# EAGLE schematic gforce_single_board (EAGLE 7.1.0)
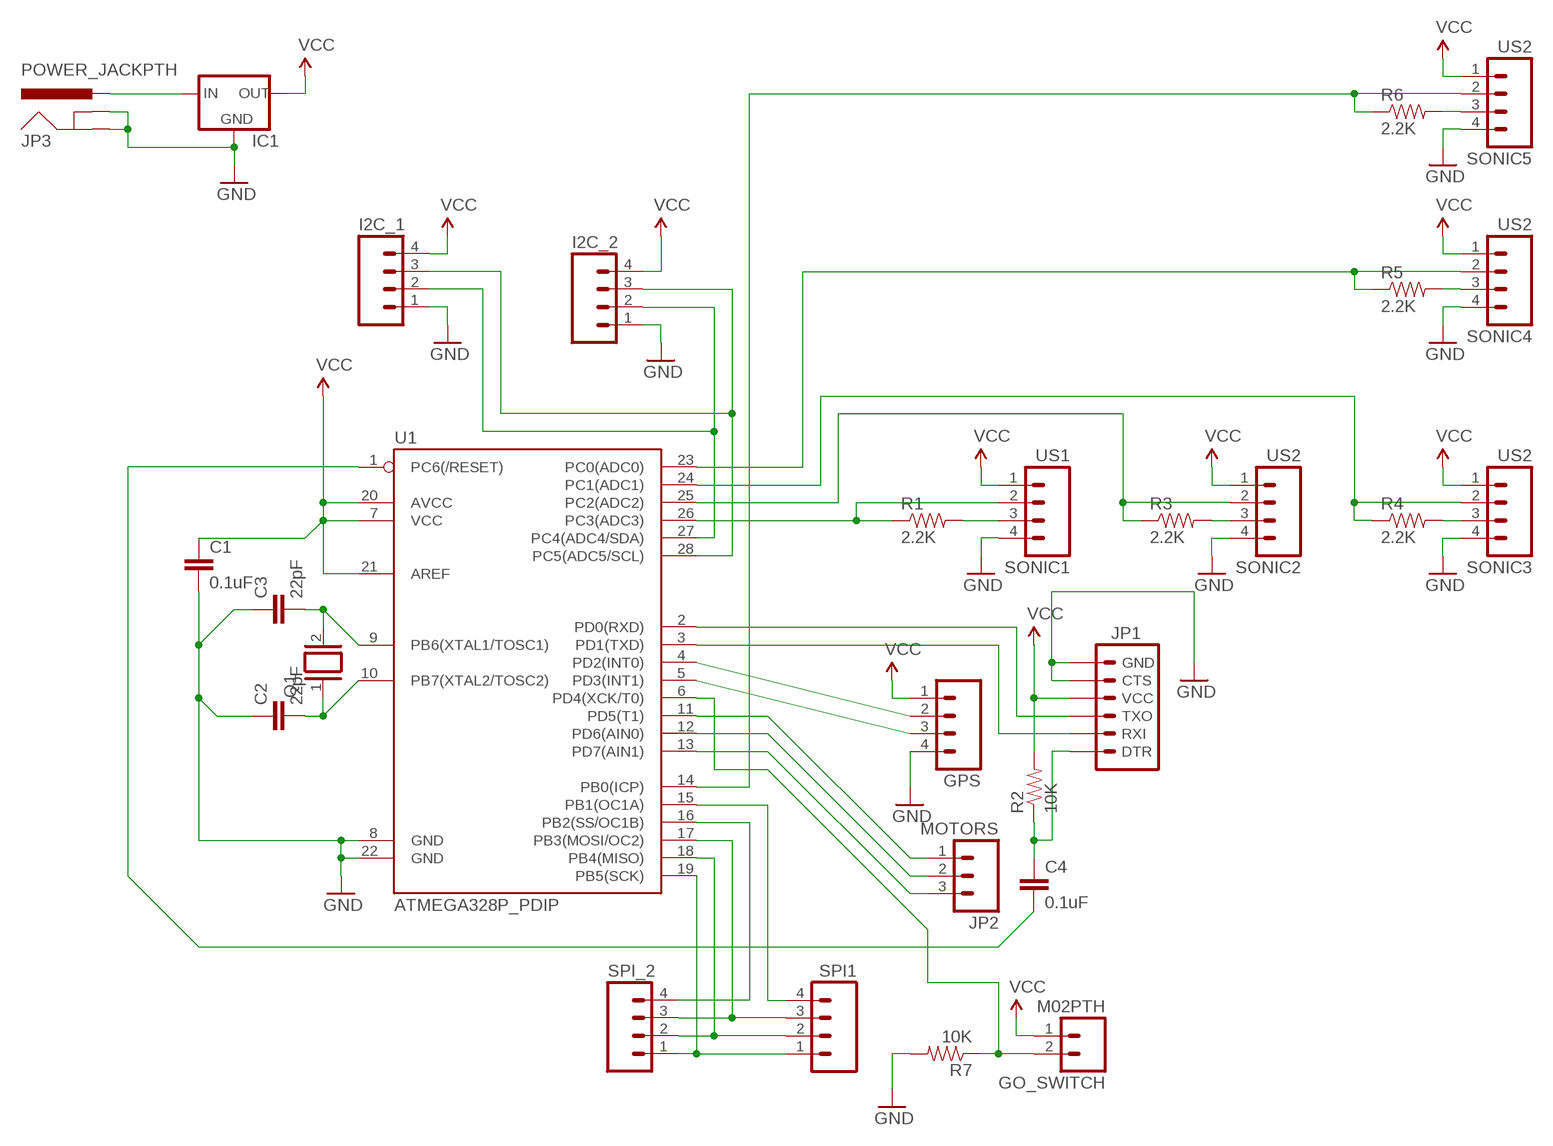
[diagram p0: schematic, sheet 1]

## Parts
C1  0.1uF  CAPPTH  [CAP-PTH-SMALL]
C2  22pF  CAPPTH  [CAP-PTH-SMALL]
C3  22pF  CAPPTH  [CAP-PTH-SMALL]
C4  0.1uF  CAPPTH  [CAP-PTH-SMALL]
GO_SWITCH  M02PTH  [1X02]
GPS  M04PTH  [1X04]
I2C_1  M04PTH  [1X04]
I2C_2  M04PTH  [1X04]
IC1  V_REG_78XX-TO-220  [TO-220-ALT]
JP1  ARDUINO_SERIAL_PROGRAMPTH  [1X06]
JP2  MOTORS  M03PTH  [1X03]
JP3  POWER_JACKPTH  [POWER_JACK_PTH]
Q1  XTAL/S  [QS]
R1  2.2K  RESISTORPTH-1/4W  [AXIAL-0.4]
R2  10K  RESISTORPTH-1/4W  [AXIAL-0.4]
R3  2.2K  RESISTORPTH-1/4W  [AXIAL-0.4]
R4  2.2K  RESISTORPTH-1/4W  [AXIAL-0.4]
R5  2.2K  RESISTORPTH-1/4W  [AXIAL-0.4]
R6  2.2K  RESISTORPTH-1/4W  [AXIAL-0.4]
R7  10K  RESISTORPTH-1/4W  [AXIAL-0.4]
SONIC1  US1  M04PTH  [1X04]
SONIC2  US2  M04PTH  [1X04]
SONIC3  US2  M04PTH  [1X04]
SONIC4  US2  M04PTH  [1X04]
SONIC5  US2  M04PTH  [1X04]
SPI1  M04PTH  [1X04]
SPI_2  M04PTH  [1X04]
U1  ATMEGA328P_PDIP  [DIL28-3]

## Nets
GND: C1.2 C2.1 C3.1 GPS.4 I2C_1.1 I2C_2.1 IC1.GND JP1.5(CTS) JP1.6(GND) JP3.GND JP3.GNDBREAK R7.P$2 SONIC1.4 SONIC2.4 SONIC3.4 SONIC4.4 SONIC5.4 U1.8(GND) U1.22(GND)
MISO: SPI1.2 SPI_2.2 U1.18(PB4(MISO))
MOSI: SPI1.3 SPI_2.3 U1.17(PB3(MOSI/OC2))
N$1: I2C_1.2 I2C_2.2 U1.27(PC4(ADC4/SDA))
N$2: I2C_1.3 I2C_2.3 U1.28(PC5(ADC5/SCL))
N$3: GPS.2 U1.4(PD2(INT0))
N$4: GPS.3 U1.5(PD3(INT1))
N$5: C3.2 Q1.2 U1.9(PB6(XTAL1/TOSC1))
N$6: C2.2 Q1.1 U1.10(PB7(XTAL2/TOSC2))
N$7: JP1.2(RXI) U1.3(PD1(TXD))
N$8: JP1.3(TXO) U1.2(PD0(RXD))
N$9: C4.2 U1.1(PC6(/RESET))
N$10: C4.1 JP1.1(DTR) R2.P$1
N$11: R3.P$2 SONIC2.3
N$12: R3.P$1 SONIC2.2 U1.25(PC2(ADC2))
N$13: JP2.1 U1.11(PD5(T1))
N$14: R4.P$2 SONIC3.3
N$15: R4.P$1 SONIC3.2 U1.24(PC1(ADC1))
N$16: R6.P$2 SONIC5.3
N$17: R6.P$1 SONIC5.2 U1.14(PB0(ICP))
N$18: JP2.2 U1.12(PD6(AIN0))
N$19: R5.P$2 SONIC4.3
N$20: R5.P$1 SONIC4.2 U1.23(PC0(ADC0))
N$21: JP2.3 U1.13(PD7(AIN1))
N$22: SPI_2.4 U1.16(PB2(SS/OC1B))
N$23: SPI1.4 U1.15(PB1(OC1A))
N$26: GO_SWITCH.2 R7.P$1 U1.6(PD4(XCK/T0))
N$27: IC1.IN JP3.PWR
SCK: SPI1.1 SPI_2.1 U1.19(PB5(SCK))
SONIC1_ECHO: R1.P$2 SONIC1.3
SONIC1_TRIGGER: R1.P$1 SONIC1.2 U1.26(PC3(ADC3))
VCC: C1.1 GO_SWITCH.1 GPS.1 I2C_1.4 I2C_2.4 IC1.OUT JP1.4(VCC) R2.P$2 SONIC1.1 SONIC2.1 SONIC3.1 SONIC4.1 SONIC5.1 U1.7(VCC) U1.20(AVCC) U1.21(AREF)

## Library data of the parts
C1-C4 = SparkFun-Passives:CAP: Capacitor Standard 0603 ceramic capacitor, and 0.1" leaded capacitor.
GO_SWITCH = SparkFun-Connectors:M02: Standard 2-pin 0.1" header. Use with - straight break away headers ( PRT-00116) - right angle break away headers (PRT-00553) - swiss pins (PRT-00743) - machine pins (PRT-00117) - female headers (PRT-00115) Molex polarized connector foot print use with: PRT-08233 with associated crimp pins and housings. 2.54_SCREWTERM for use with PRT-10571. 3.5mm Screw Terminal footprints for PRT-08084 5mm Screw Terminal footprints for use with PRT-08432
GPS I2C_1 I2C_2 SONIC1-SONIC5 SPI1 SPI_2 = SparkFun-Connectors:M04: Header 4 Standard 4-pin 0.1" header. Use with straight break away headers (SKU : PRT-00116), right angle break away headers (PRT-00553), swiss pins (PRT-00743), machine pins (PRT-00117), and female headers (PRT-00115). Molex polarized connector foot print use with SKU : PRT-08231 with associated crimp pins and housings. 1MM SMD Version SKU: PRT-10208
IC1 = SparkFun-PowerIC:V_REG_78XX: Voltage Regulator Standard 7805 5V regulator. IGO (Input Ground Output). Spark Fun Electronics SKU : COM-00107
JP1 = SparkFun-Connectors:ARDUINO_SERIAL_PROGRAM: FTDI connector footprints
JP2 = SparkFun-Connectors:M03: Header 3 Standard 3-pin 0.1" header. Use with straight break away headers (SKU : PRT-00116), right angle break away headers (PRT-00553), swiss pins (PRT-00743), machine pins (PRT-00117), and female headers (PRT-00115). Molex polarized connector foot print use with SKU : PRT-08232 with associated crimp pins and housings.
JP3 = SparkFun-Connectors:POWER_JACK: Power Jack This is the standard 5.5mm barrel jack for power. The PTH is the most common, proven, reliable, footprint. The Slot footprint only works if the mill layer is transmitted to the PCB fab house so be warned. Mating wall wart : TOL-00298 (and others); PROD_ID: CONN-08197
Q1 = special:XTAL/S: CRYSTAL
R1-R7 = SparkFun-Resistors:RESISTOR: Resistor Basic schematic elements and footprints for 0603, 1206, and PTH resistors.
U1 = SparkFun-DigitalIC:ATMEGA328P_PDIP: uC used in the Arduino 32kb flash, 1k EEPROM, 2k SRAM This is the through-hole version of this chip.